# EAGLE design ABFPanelV1 (EAGLE 8.2.2)
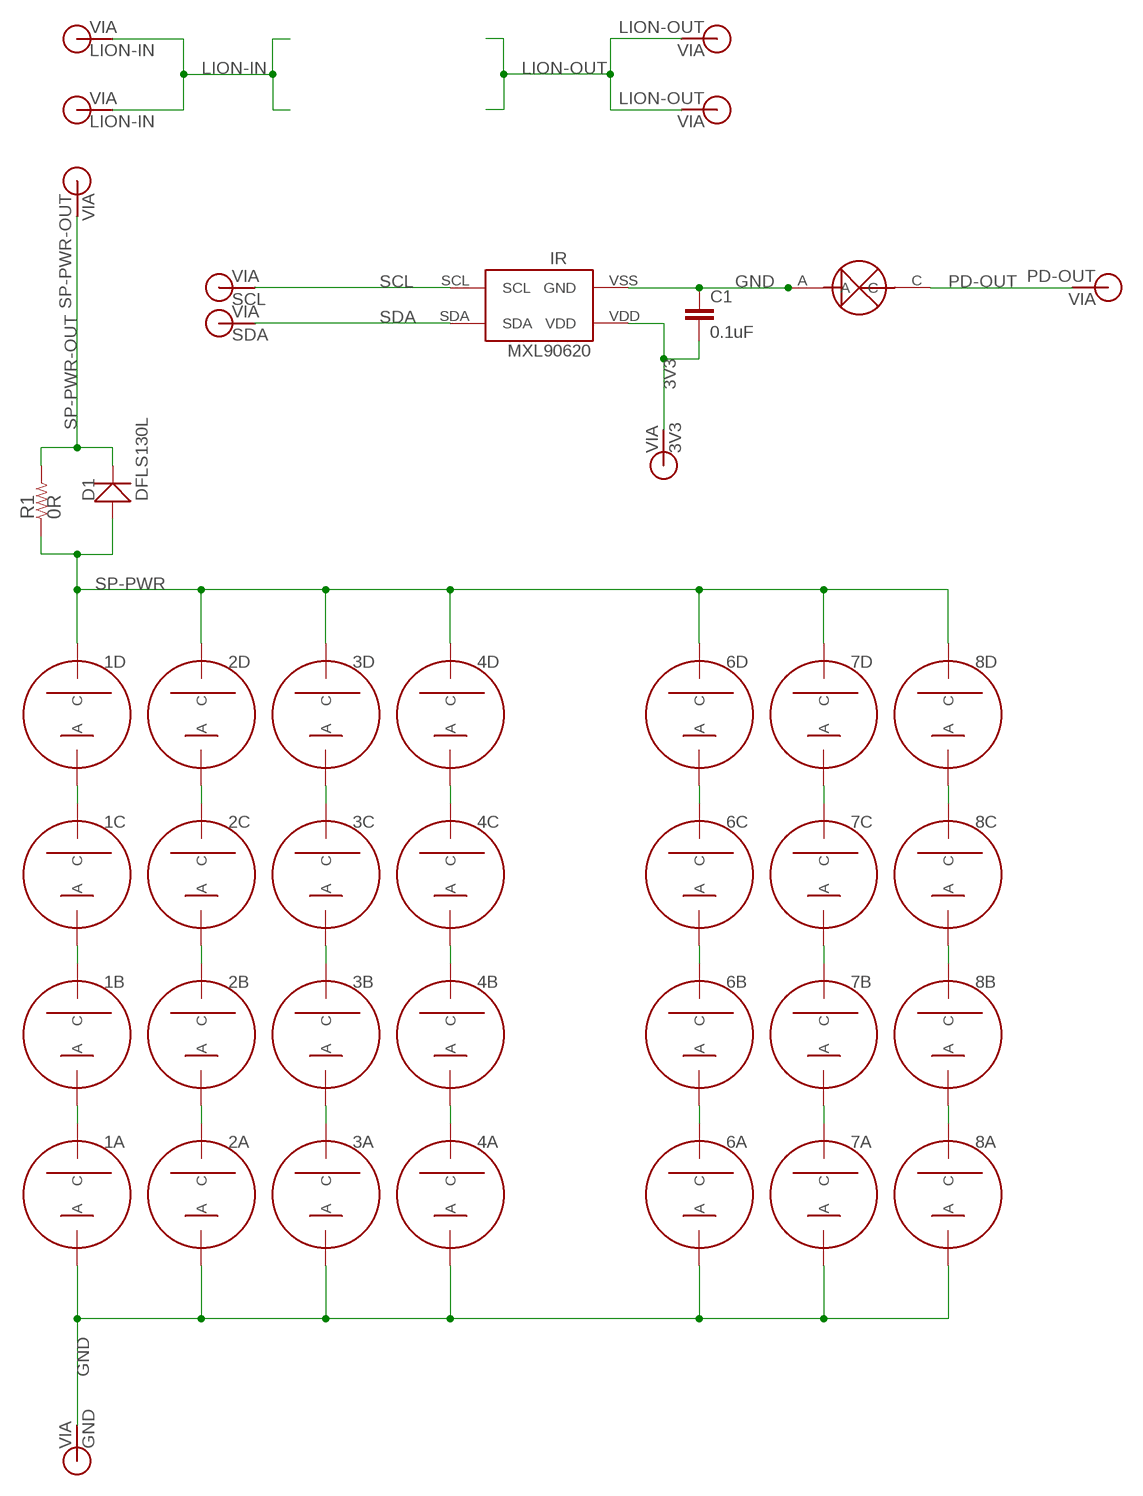
[diagram p0: schematic, sheet 1]

## Parts
1A  SOLARCELLV3  [TRISOLX-V3]
1B  SOLARCELLV3  [TRISOLX-V3]
1C  SOLARCELLV3  [TRISOLX-V3]
1D  SOLARCELLV3  [TRISOLX-V3]
2A  SOLARCELLV3  [TRISOLX-V3]
2B  SOLARCELLV3  [TRISOLX-V3]
2C  SOLARCELLV3  [TRISOLX-V3]
2D  SOLARCELLV3  [TRISOLX-V3]
3A  SOLARCELLV3  [TRISOLX-V3]
3B  SOLARCELLV3  [TRISOLX-V3]
3C  SOLARCELLV3  [TRISOLX-V3]
3D  SOLARCELLV3  [TRISOLX-V3]
3V3  3V3  VIA-60MIL  [VIA-60MIL]
4A  SOLARCELLV3  [TRISOLX-V3]
4B  SOLARCELLV3  [TRISOLX-V3]
4C  SOLARCELLV3  [TRISOLX-V3]
4D  SOLARCELLV3  [TRISOLX-V3]
6A  SOLARCELLV3  [TRISOLX-V3]
6B  SOLARCELLV3  [TRISOLX-V3]
6C  SOLARCELLV3  [TRISOLX-V3]
6D  SOLARCELLV3  [TRISOLX-V3]
7A  SOLARCELLV3  [TRISOLX-V3]
7B  SOLARCELLV3  [TRISOLX-V3]
7C  SOLARCELLV3  [TRISOLX-V3]
7D  SOLARCELLV3  [TRISOLX-V3]
8A  SOLARCELLV3  [TRISOLX-V3]
8B  SOLARCELLV3  [TRISOLX-V3]
8C  SOLARCELLV3  [TRISOLX-V3]
8D  SOLARCELLV3  [TRISOLX-V3]
C1  0.1uF  CAP0805  [0805]
D1  DFLS130L  [PWRDI-123]
GND  GND  VIA-60MIL  [VIA-60MIL]
IR  MXL90620  [MXL90620]
PD  PHOTODETECTOR  [PHOTODECTORDEVICE2]
PD-OUT  PD-OUT  VIA-60MIL  [VIA-60MIL]
PWR-OUT  SP-PWR-OUT  VIA-60MIL  [VIA-60MIL]
R1  0R  RES1210  [1210]
SCL  SCL  VIA-60MIL  [VIA-60MIL]
SDA  SDA  VIA-60MIL  [VIA-60MIL]
V1  LION-IN  VIA-60MIL  [VIA-60MIL]
V2  LION-IN  VIA-60MIL  [VIA-60MIL]
V3  LION-OUT  VIA-60MIL  [VIA-60MIL]
V4  LION-OUT  VIA-60MIL  [VIA-60MIL]

## Nets
3V3: 3V3.P$1 C1.2 IR.VDD
GND: 1A.ANODE(A) 2A.ANODE(A) 3A.ANODE(A) 4A.ANODE(A) 6A.ANODE(A) 7A.ANODE(A) 8A.ANODE(A) C1.1 GND.P$1 IR.VSS(GND) PD.A
LION-IN: V1.P$1 V2.P$1
LION-OUT: V3.P$1 V4.P$1
N$1: 2C.CATHODE(C) 2D.ANODE(A)
N$2: 1C.CATHODE(C) 1D.ANODE(A)
N$3: 1B.CATHODE(C) 1C.ANODE(A)
N$4: 1A.CATHODE(C) 1B.ANODE(A)
N$5: 2B.CATHODE(C) 2C.ANODE(A)
N$6: 2A.CATHODE(C) 2B.ANODE(A)
N$7: 3C.CATHODE(C) 3D.ANODE(A)
N$8: 3B.CATHODE(C) 3C.ANODE(A)
N$9: 3A.CATHODE(C) 3B.ANODE(A)
N$10: 4C.CATHODE(C) 4D.ANODE(A)
N$11: 4B.CATHODE(C) 4C.ANODE(A)
N$12: 4A.CATHODE(C) 4B.ANODE(A)
N$17: 6C.CATHODE(C) 6D.ANODE(A)
N$18: 6B.CATHODE(C) 6C.ANODE(A)
N$19: 6A.CATHODE(C) 6B.ANODE(A)
N$20: 7C.CATHODE(C) 7D.ANODE(A)
N$21: 7B.CATHODE(C) 7C.ANODE(A)
N$22: 7A.CATHODE(C) 7B.ANODE(A)
N$23: 8C.CATHODE(C) 8D.ANODE(A)
N$24: 8B.CATHODE(C) 8C.ANODE(A)
N$25: 8A.CATHODE(C) 8B.ANODE(A)
PD-OUT: PD-OUT.P$1 PD.C
SCL: IR.SCL SCL.P$1
SDA: IR.SDA SDA.P$1
SP-PWR: 1D.CATHODE(C) 2D.CATHODE(C) 3D.CATHODE(C) 4D.CATHODE(C) 6D.CATHODE(C) 7D.CATHODE(C) 8D.CATHODE(C) D1.A R1.P$1
SP-PWR-OUT: D1.C PWR-OUT.P$1 R1.P$2

## Library data of the parts
1A 1B 1C 1D 2A 2B 2C 2D 3A 3B 3C 3D 4A 4B 4C 4D 6A 6B 6C 6D 7A 7B 7C 7D 8A 8B 8C 8D = BrownSpaceEngineering:SOLARCELLV3
3V3 GND PD-OUT PWR-OUT SCL SDA V1-V4 = BrownSpaceEngineering:VIA
C1 = CNTRL_BOARD:CAP: Capacitor Standard 0603 ceramic capacitor, and 0.1" leaded capacitor.
D1 = BrownSpaceEngineering:DFLS130L
IR = CNTRL_BOARD:MXL90620
PD = Solar Panel Parts:PHOTODETECTOR
R1 = BrownSpaceEngineering:RES

## Board
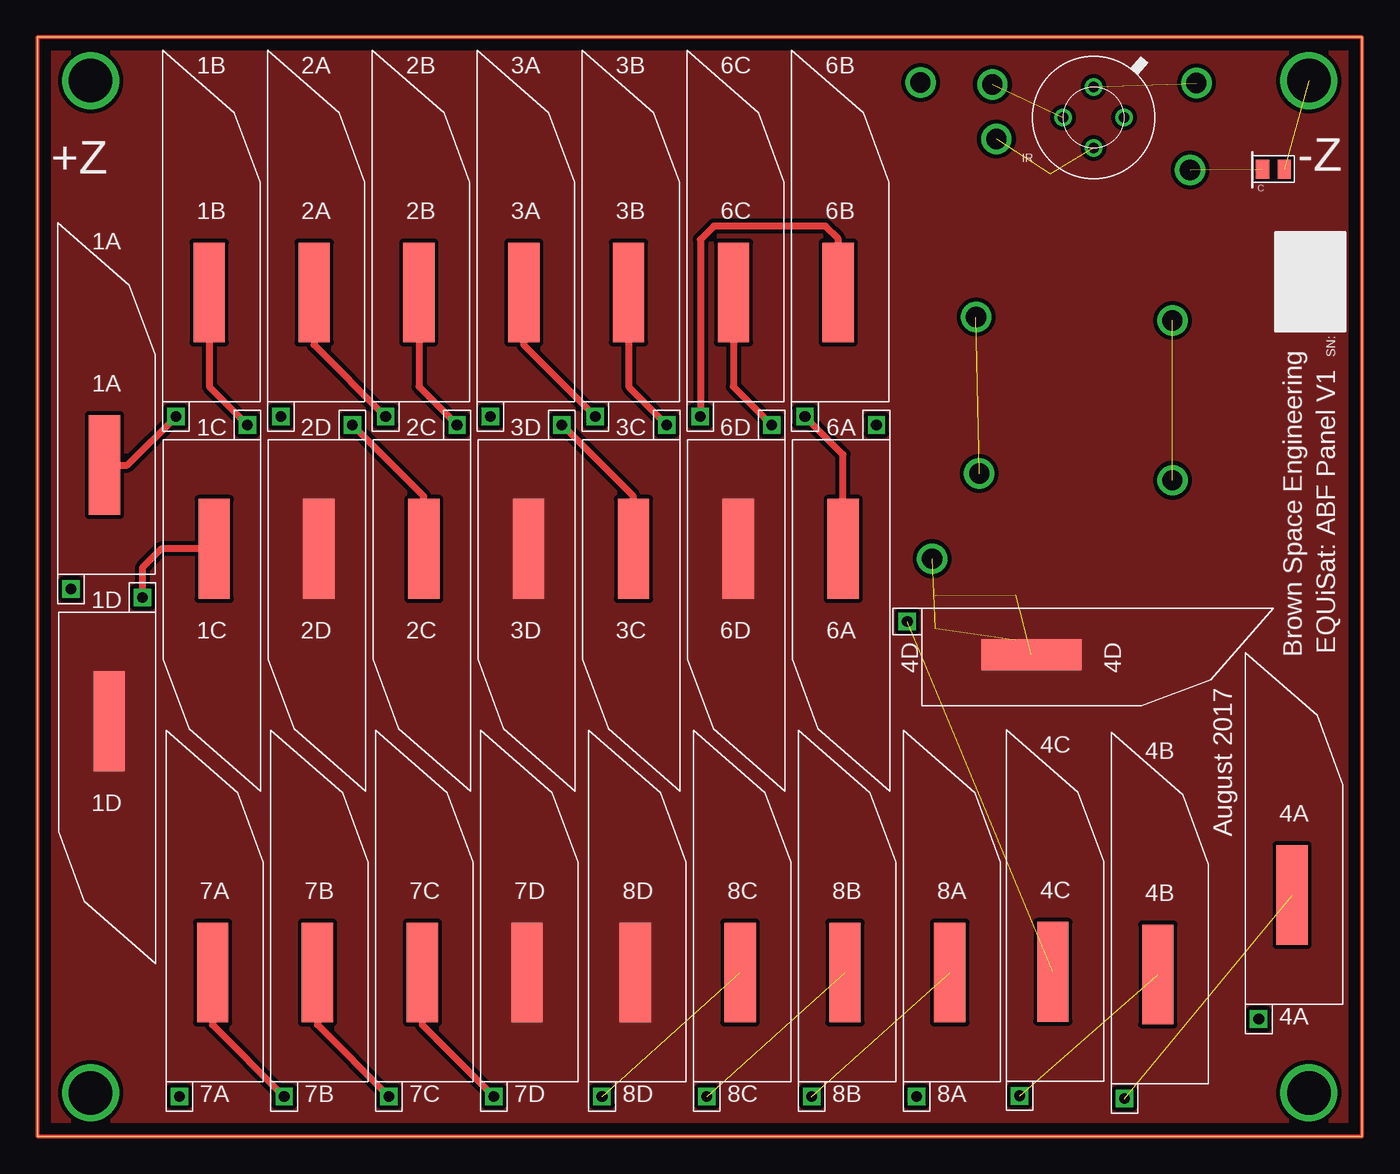
[diagram p1: board, top side]
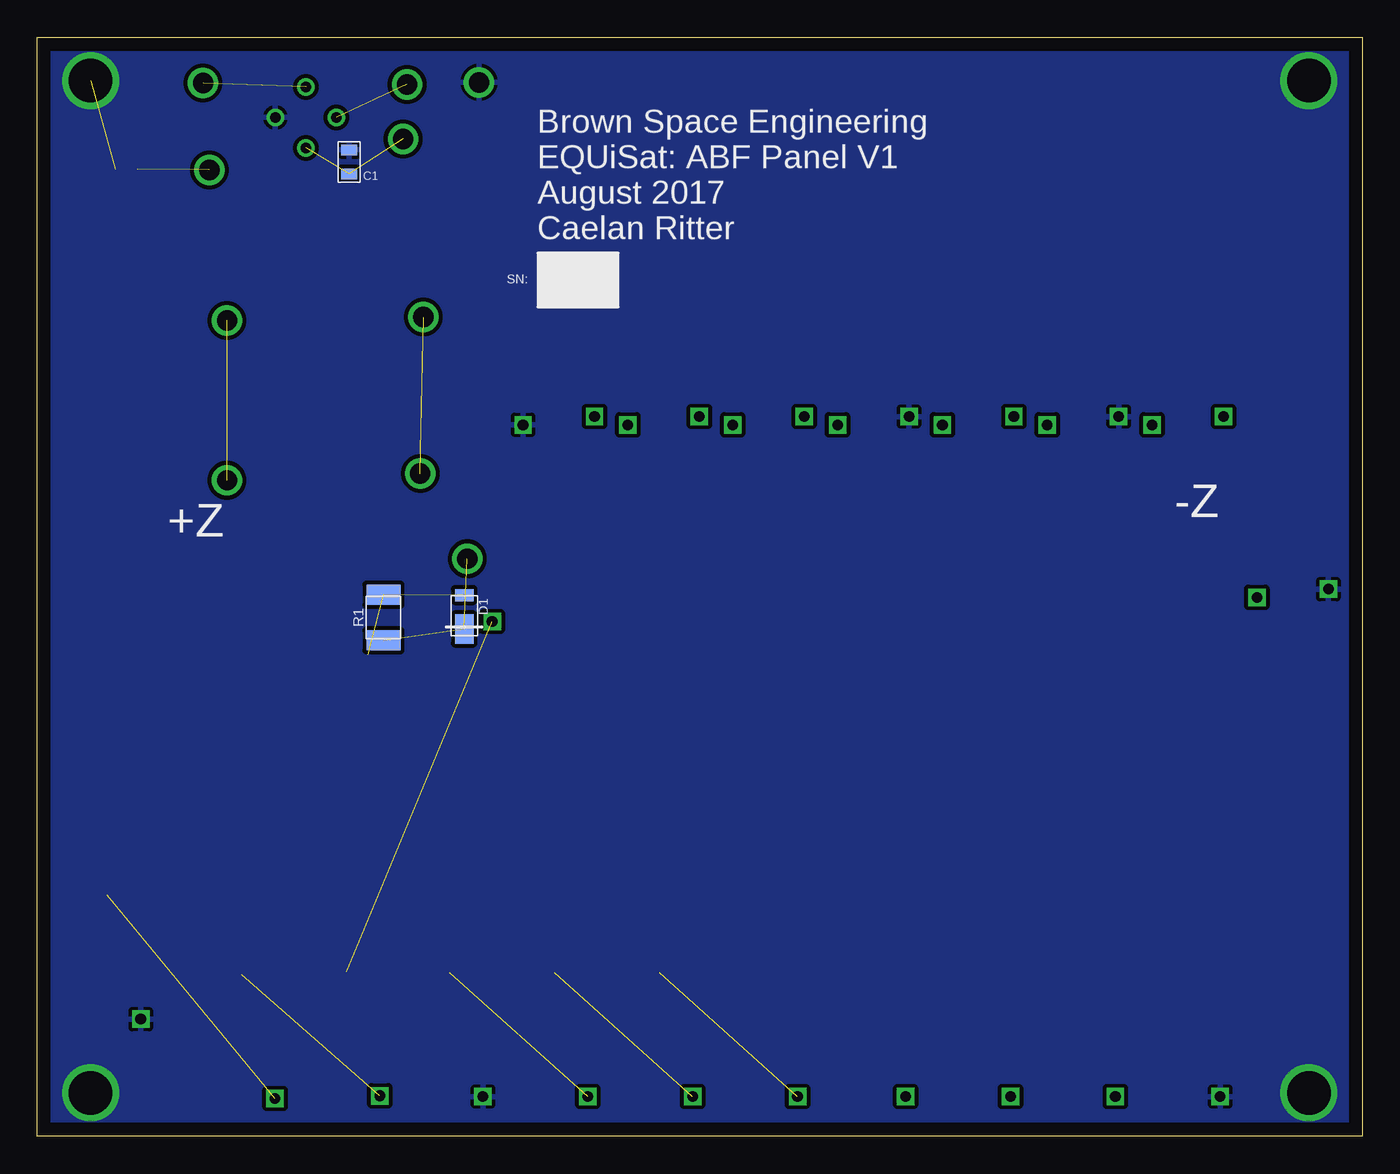
[diagram p2: board, bottom side, seen from below]

Size 99.5 x 82.5 mm. Coordinates in mm from the lower left corner, seen from the top.
Outline: 0,0 99.5,0 99.5,82.5 0,82.5 0,0
Copper layers (1*16): Top 0.035mm / dielectric 1.5mm / Bottom 0.035mm
Design rules "default": minimum track width 10mil, minimum drill 24mil, track to track 8mil, track to pad 8mil, pad to pad 8mil, via to via 8mil, smd to smd 8mil, copper to edge 40mil, drill to drill 8mil, minimum pad ring 10mil, minimum via ring 8mil, stop-mask expansion 4mil, vias tented up to drill 0mil, thermal gap 10mil

### Footprints (pad centres in the part's own frame; a part is rotated, then mirrored left to right if it is on the bottom)
TRISOLX-V3 = drill 0.8 square: ANODE 13.53,-1.54 | smd 7.5 x 2.35: CATHODE 4.22,0.96
VIA-60MIL = drill 1.524: P$1 0,0
0805 = smd 0.8 x 1.2: 1 -0.9,0; 2 0.9,0
PWRDI-123 = smd 0.9 x 1.4: A 1.45,0 | smd 2.2 x 1.4: C -1.1,0
MXL90620 = drill 0.8: SCL 2.293,0; VDD -2.293,0; VSS 0,-2.294 | drill 0.8 pad 1.2: SDA 0,2.294
PHOTODECTORDEVICE2 = smd 1 x 1.45: A 0.76,0.4; C -0.88,0.4
1210 = smd 1.52 x 2.54: P$1 -1.71,0 | smd 1.51 x 2.54: P$2 1.71,0

### Placement (x,y rotation side)
1A  4.08,54.61 270 top
1B  11.95,67.56 270 top
1C  14.24,39.88 90 top
1D  6.36,26.92 90 top
2A  19.82,67.56 270 top
2B  27.7,67.56 270 top
2C  29.98,39.88 90 top
2D  22.11,39.88 90 top
3A  35.57,67.56 270 top
3B  43.45,67.56 270 top
3C  45.73,39.88 90 top
3D  37.86,39.88 90 top
3V3  72.03,74.87 0 top
4A  93.27,22.33 270 top
4B  83.19,16.36 270 top
4C  75.32,16.56 270 top
4D  78.87,37.1 180 top
6A  61.48,39.88 90 top
6B  59.19,67.56 270 top
6C  51.32,67.56 270 top
6D  53.61,39.88 90 top
7A  12.2,16.51 270 top
7B  20.08,16.51 270 top
7C  27.95,16.51 270 top
7D  35.83,16.51 270 top
8A  67.57,16.51 270 top
8B  59.7,16.51 270 top
8C  51.82,16.51 270 top
8D  43.95,16.51 270 top
C1  76.08,73.15 270 bottom
D1  67.44,39.18 90 bottom
GND  66.33,79.12 0 top
IR  79.33,76.49 90 top
PD  92.9,72.2 0 top
PD-OUT  86.58,72.55 0 top
PWR-OUT  67.22,43.36 0 top
R1  73.5,38.94 270 bottom
SCL  87.05,79.07 0 top
SDA  71.73,78.97 0 top
V1  70.75,49.75 0 top
V2  70.5,61.5 0 top
V3  85.25,61.25 0 top
V4  85.25,49.25 0 top

### Tracks (layer width: path | path; a pad name or v marks a point on that pad's centre or on a via)
3V3  (2 unrouted)
GND  (via drill 3.26)  (1 unrouted)
  other vias: 4,79.25 4,3.25 95.5,3.25 95.5,79.25
  pour Bottom (isolate 0.305): -5.85,99.18 129.54,99.18 129.54,-7.62 -6.35,-7.62
LION-IN  (1 unrouted)
LION-OUT  (1 unrouted)
N$1
  Top 0.508: 2C.CATHODE 29.02,48.03 2D.ANODE
N$2
  Top 0.508: 1C.CATHODE 9.31,44.1 7.89,42.67 7.89,40.47 1D.ANODE
N$3
  Top 0.508: 1B.CATHODE 12.91,56.27 1C.ANODE
N$4
  Top 0.508: 1A.CATHODE 6.77,50.39 1B.ANODE
N$5
  Top 0.508: 2B.CATHODE 28.66,56.27 2C.ANODE
N$6
  Top 0.508: 2A.CATHODE 20.78,59.41 2B.ANODE
N$7
  Top 0.508: 3C.CATHODE 44.77,48.03 3D.ANODE
N$8
  Top 0.508: 3B.CATHODE 44.41,56.27 3C.ANODE
N$9
  Top 0.508: 3A.CATHODE 36.53,59.41 3B.ANODE
N$10  (1 unrouted)
N$11  (1 unrouted)
N$12  (1 unrouted)
N$14
  Top 0.305: 0,82.5 0,0 99.5,0 99.5,82.5 0,82.5
N$17
  Top 0.508: 6C.CATHODE 52.28,56.27 6D.ANODE
N$18
  Top 0.508: 6B.CATHODE 60.15,67.37 59.19,68.33 50.81,68.33 49.8,67.31 49.8,54.05 6C.ANODE
N$19
  Top 0.508: 6A.CATHODE 60.52,51.17 6B.ANODE
N$20
  Top 0.508: 7C.CATHODE 28.91,8.35 7D.ANODE
N$21
  Top 0.508: 7B.CATHODE 21.04,8.35 7C.ANODE
N$22
  Top 0.508: 7A.CATHODE 13.16,8.35 7B.ANODE
N$23  (1 unrouted)
N$24  (1 unrouted)
N$25  (1 unrouted)
PD-OUT  (1 unrouted)
SCL  (1 unrouted)
SDA  (1 unrouted)
SP-PWR  (2 unrouted)
  pour Top (isolate 0.305, no thermals): -7.62,107.95 132.08,107.95 132.08,-10.16 -7.62,-10.16
SP-PWR-OUT  (2 unrouted)

### Text on the board
tPlace: -Z | +Z | SN: | Brown Space Engineering | EQUiSat: ABF Panel V1 | August 2017
bPlace: Brown Space Engineering / EQUiSat: ABF Panel V1 / August 2017 / Caelan Ritter | SN: | -Z | +Z